# Altium schematic sheet Sense_Plates.SchDoc
size Tabloid; Organization: Altium Limited; Address1: L3, 12a Rodborough Rd; Address2: Frenchs Forest; Address3: NSW; Address4: Australia 2086
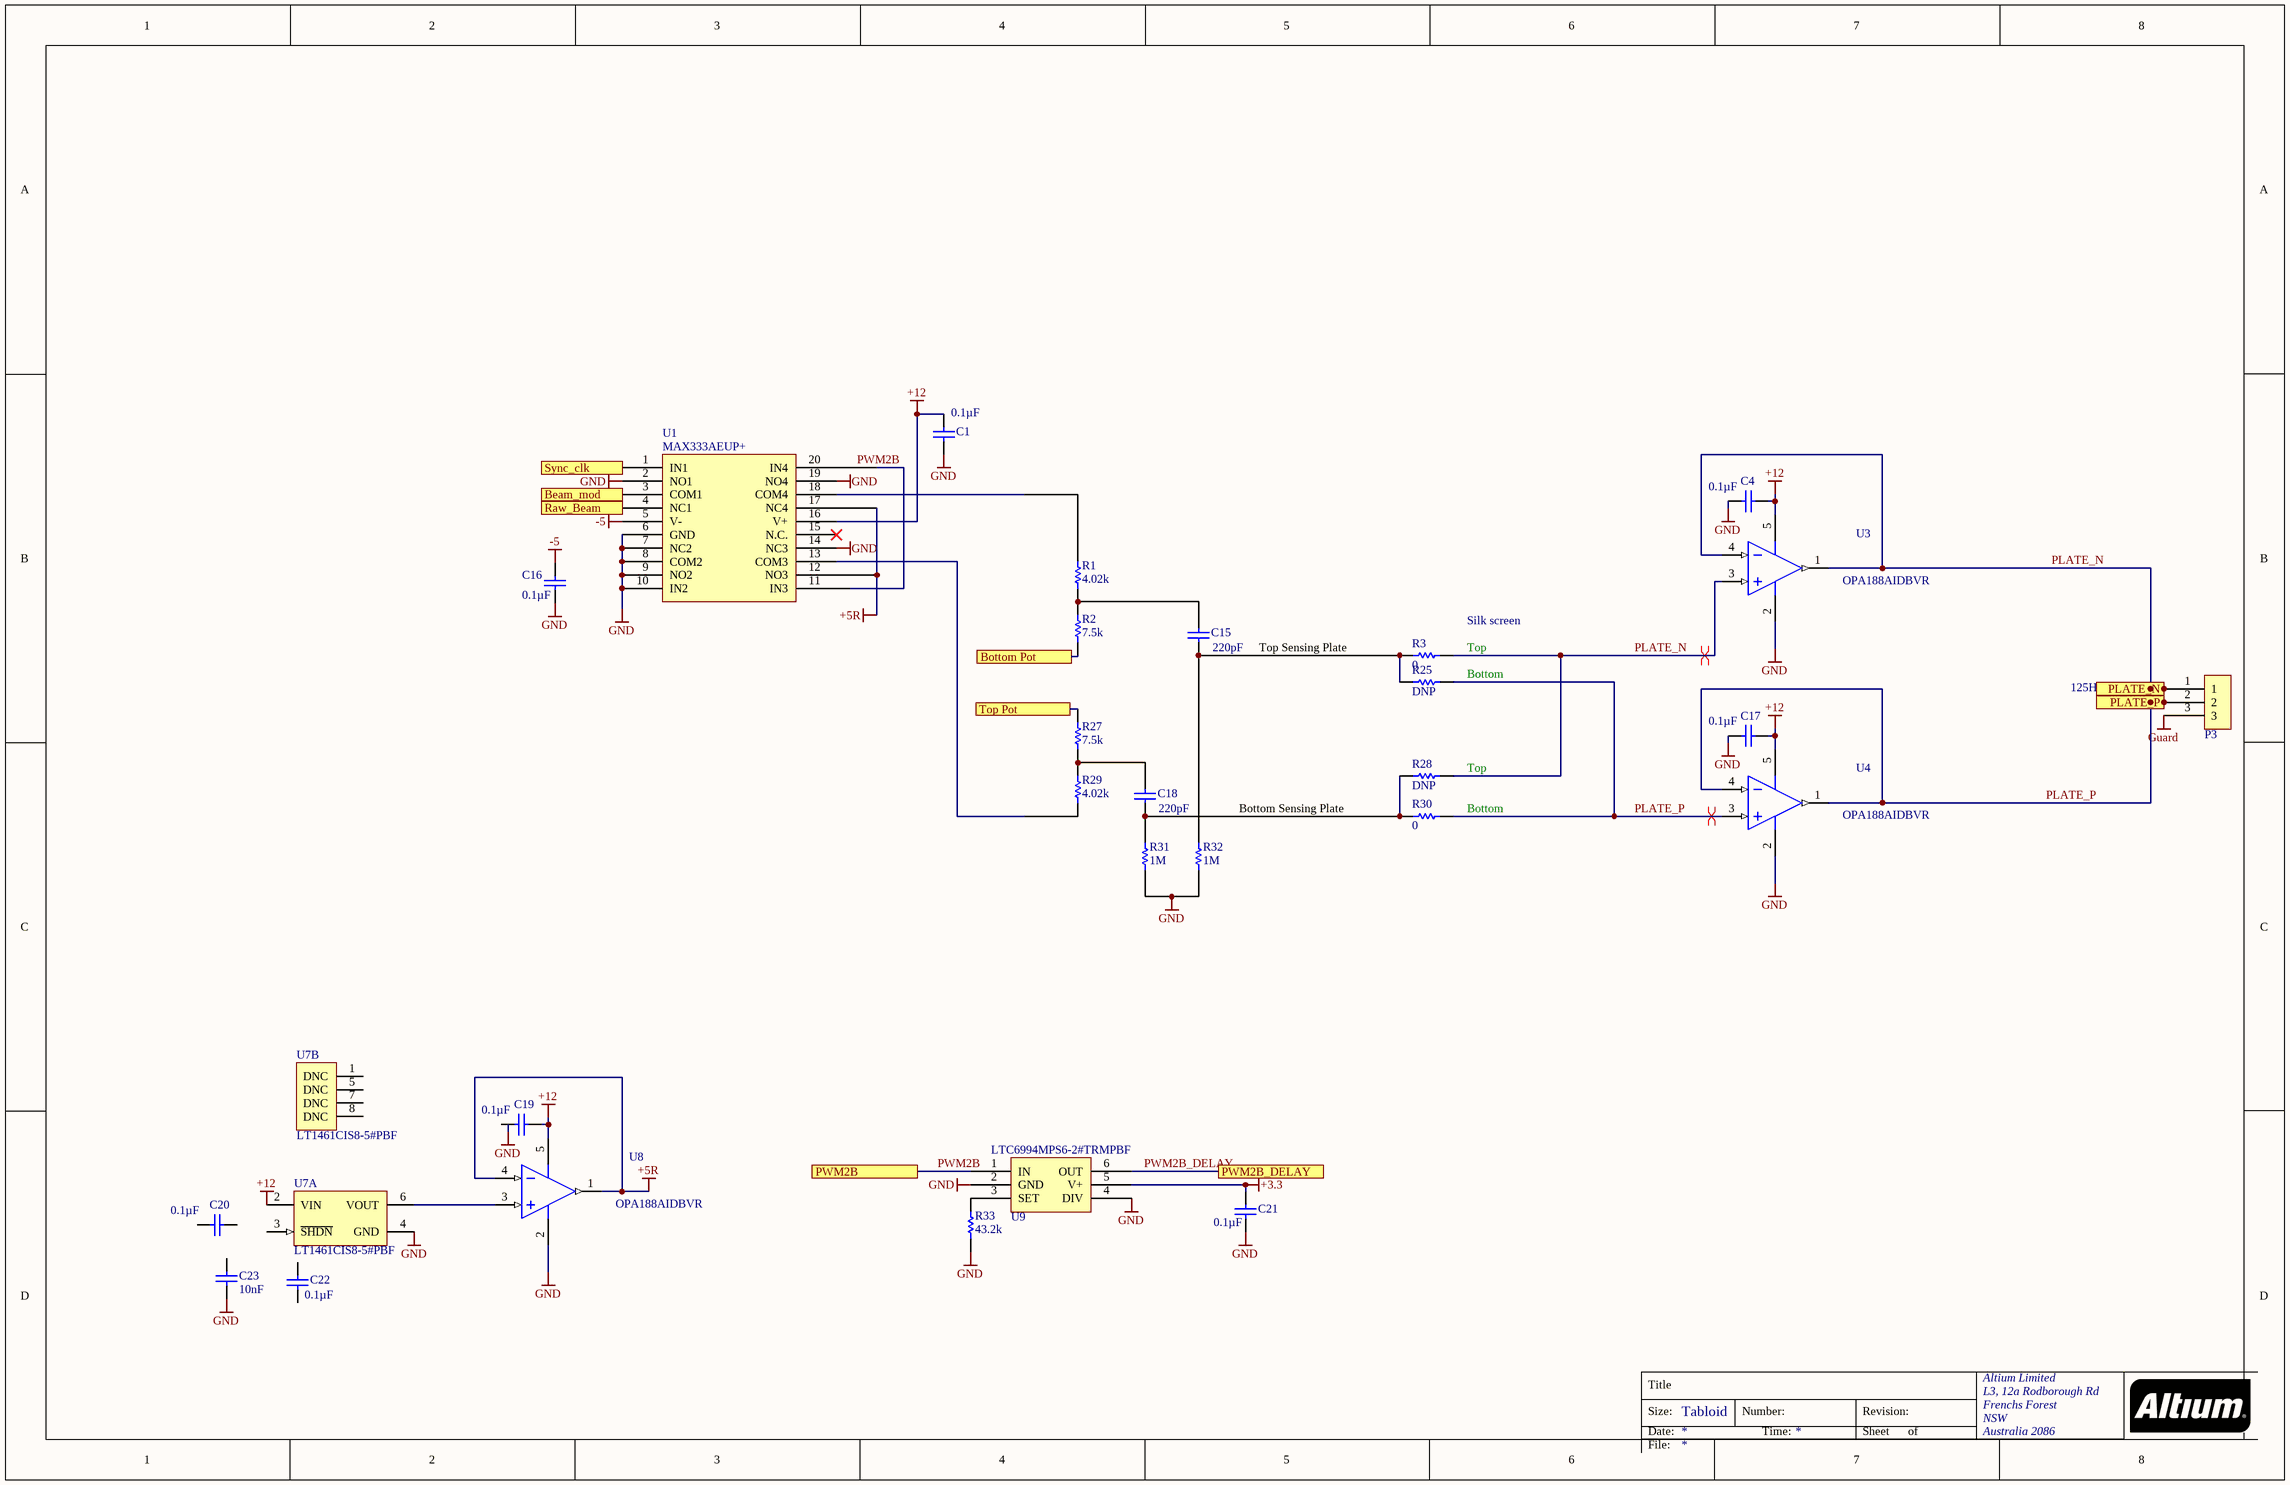
[diagram p0: Sense_Plates.SchDoc]

## Parts
C1  Capacitance: 0.1µF  [CAPC0805(2012)145_N]  (hidden comment: CAP CER 0.1UF 25V X7R 0805)
C4  Capacitance: 0.1µF  [CAPC0805(2012)145_N]  (hidden comment: CAP CER 0.1UF 25V X7R 0805)
C15  Capacitance: 220pF  [CAPC0805(2012)155_L]  (hidden comment: CAP CER 1UF 25V X7R 0805)
C16  Capacitance: 0.1µF  [CAPC0805(2012)145_N]  (hidden comment: CAP CER 0.1UF 25V X7R 0805)
C17  Capacitance: 0.1µF  [CAPC0805(2012)145_N]  (hidden comment: CAP CER 0.1UF 25V X7R 0805)
C18  Capacitance: 220pF  [CAPC0805(2012)155_L]  (hidden comment: CAP CER 1UF 25V X7R 0805)
C19  Capacitance: 0.1µF  [CAPC0805(2012)145_N]  (hidden comment: CAP CER 0.1UF 25V X7R 0805)
C20  Capacitance: 0.1µF  [CAPC0805(2012)145_N]  (hidden comment: CAP CER 0.1UF 25V X7R 0805)
C21  Capacitance: 0.1µF  [CAPC0805(2012)145_N]  (hidden comment: CAP CER 0.1UF 25V X7R 0805)
C22  Capacitance: 0.1µF  [CAPC0805(2012)145_N]  (hidden comment: CAP CER 0.1UF 25V X7R 0805)
C23  Capacitance: 10nF  [CAPC0805(2012)145_N]  (hidden comment: Multilayer Ceramic Capacitors MLCC - SMD/SMT 0.01uF 50volts 10% X7R)
P3  Triax_Conn  [Triax_Conn]  (value not drawn)
R1  4.02k  [RESC0402(1005)_M]
R2  7.5k  [RESC0402(1005)_M]
R3  0  [RESC0402(1005)_M]
R25  DNP  [RESC0402(1005)_M]
R27  7.5k  [RESC0402(1005)_M]
R28  DNP  [RESC0402(1005)_M]
R29  4.02k  [RESC0402(1005)_M]
R30  0  [RESC0402(1005)_M]
R31  1M  [RESC0402(1005)_M]
R32  1M  [RESC0402(1005)_M]
R33  43.2k  [RESC0402(1005)_M]
U1  MAX333AEUP+  [TSOP65P640X90-20N]
U3  OPA188AIDBVR  [DBV0005A_M]
U4  OPA188AIDBVR  [DBV0005A_M]
U7  LT1461CIS8-5#PBF  [LT-S8-8_L]  (parts A,B of 2)
U8  OPA188AIDBVR  [DBV0005A_M]
U9  LTC6994MPS6-2#TRMPBF  [LTC6994MPS6-2#TRMPBF]

## Ports
Beam_mod, Bottom Pot, PLATE_N, PLATE_P, PWM2B, PWM2B_DELAY, Raw_Beam, Sync_clk, Top Pot

## Nets
+3.3: C21.1 U9.5(V+)
+5R: U1.12(NO3) U1.17(NC4) U8.1(OUT) U8.4(IN-)
+12: C1.1 C4.2 C17.2 C19.2 U1.16(V+) U3.5(V+) U4.5(V+) U7.2(VIN) U8.5(V+)
-5: C16.1 U1.5(V-)
GND: C1.2 C4.1 C16.2 C17.1 C21.2 C23.2 R31.1 R32.1 R33.1 U1.2(NO1) U1.6(GND) U1.7(NC2) U1.8(COM2) U1.9(NO2) U1.10(IN2) U1.14(NC3) U1.19(NO4) U3.2(V-) U4.2(V-) U7.4(GND) U8.2(V-) U9.2(GND) U9.4(DIV)
Guard: P3.3
Beam_mod: U1.3(COM1) ; port Beam_mod
Bottom Pot: R2.1 ; port Bottom Pot
PLATE_N: P3.1 R3.1 R28.1 U3.1(OUT) U3.3(IN+) U3.4(IN-) ; port PLATE_N
PLATE_P: P3.2 R25.1 R30.1 U4.1(OUT) U4.3(IN+) U4.4(IN-) ; port PLATE_P
PWM2B: U1.11(IN3) U1.20(IN4) U9.1(IN) ; port PWM2B
PWM2B_DELAY: U9.6(OUT) ; port PWM2B_DELAY
Raw_Beam: U1.4(NC1) ; port Raw_Beam
Sync_clk: U1.1(IN1) ; port Sync_clk
Top Pot: R27.2 ; port Top Pot
NetC15_1: C15.1 R3.2 R25.2 R32.2
NetC15_2: C15.2 R1.1 R2.2
NetC18_1: C18.1 R28.2 R30.2 R31.2
NetC18_2: C18.2 R27.1 R29.2
NetR1_2: R1.2 U1.18(COM4)
NetR29_1: R29.1 U1.13(COM3)
NetR33_2: R33.2 U9.3(SET)
NetU7_6: U7.6(VOUT) U8.3(IN+)

Not connected (* = marked no-connect by the designer): C19 1; C20 1 2; C22 1 2; C23 1; U1 15(N.C.)*; U7 1(DNC) 3(~{SHDN}) 5(DNC) 7(DNC) 8(DNC)

## Layout directives
differential pair: PLATE_N, PLATE_P

## Notes on the sheet
- Silk screen
- Top Sensing Plate
- Top
- Bottom
- 125Hz
- Bottom Sensing Plate
- (near R28) Top
- Title
- Size:
- Date:
- Tabloid
- Number:
- Time:
- Revision:
- Sheet
- of
- File:

## Library data of the parts
C1 C4 C16 C17 C19-C22 = CMP-1036-04795-1: Manufacturer: Murata Electronics North America; Manufacturer Part Number: GRM21BR71E104KA01L; Tolerance: ±10%; Supplier 1: Digi-Key; Supplier Part Number 1: 490-1673-6-ND; RoHS: RoHS Compliant; Category: Capacitors; Stock 1: 891652; Pricing 1: 1=0.2, 10=0.145, 100=0.0683, 500=0.04788, 1000=0.03964 (USD); Packaging: Digi-Reel®; Part Status: Active; Voltage - Rated: 25V; Temperature Coefficient: X7R; Operating Temperature: -55°C ~ 125°C; Features: -; Ratings: -; Applications: General Purpose; Mounting Type: Surface Mount, MLCC; Package / Case: 0805 (2012 Metric); Size / Dimension: 0.079" L x 0.049" W (2.00mm x 1.25mm); Height - Seated (Max): -; Thickness (Max): 0.053" (1.35mm); Lead Spacing: -; Lead Style: -; ComponentLink1URL: http://www.murata.com/~/media/webrenewal/support/library/catalog/products/capacitor/mlcc/c02e.ashx; ComponentLink1Description: http://www.murata.com/~/media/webrenewal/support/library/catalog/products/capacitor/mlcc/c02e.ashx
C15 C18 = CMP-1036-04882-1: Manufacturer: Murata Electronics North America; Manufacturer Part Number: GRM21BR71E105KA99L; Tolerance: ±10%; Supplier 1: Digi-Key; Supplier Part Number 1: 490-6484-6-ND; RoHS: RoHS Compliant; Category: Capacitors; Stock 1: 295074; Pricing 1: 1=0.14, 10=0.099, 100=0.0468, 500=0.0328, 1000=0.02715 (USD); Packaging: Digi-Reel®; Part Status: Active; Voltage - Rated: 25V; Temperature Coefficient: X7R; Operating Temperature: -55°C ~ 125°C; Features: -; Ratings: -; Applications: General Purpose; Mounting Type: Surface Mount, MLCC; Package / Case: 0805 (2012 Metric); Size / Dimension: 0.079" L x 0.049" W (2.00mm x 1.25mm); Height - Seated (Max): -; Thickness (Max): 0.053" (1.35mm); Lead Spacing: -; Lead Style: -; ComponentLink1URL: http://www.murata.com/~/media/webrenewal/support/library/catalog/products/capacitor/mlcc/c02e.ashx; ComponentLink1Description: http://www.murata.com/~/media/webrenewal/support/library/catalog/products/capacitor/mlcc/c02e.ashx
C23 = CMP-1036-04795-1: Manufacturer: Kemet; Manufacturer Part Number: C0805C103K5RACAUTO; Voltage Rating: 50V; Supplier 1: Digi-Key; Supplier Part Number 1: 399-6924-1-ND; Stock 1: 63236; Pricing 1: 1=0.12, 10=0.087, 100=0.041, 500=0.0287, 1000=0.0238 (USD); Mount: Surface Mount; Case/Package: 0805; Case Code (Metric): 2012; Case Code (Imperial): 0805; Dielectric Material: Ceramic; Contact Plating: Tin; Min Operating Temperature: -55°C; Max Operating Temperature: 125°C; Tolerance: 10%; Packaging: Tape and Reel; Package Quantity: 1; Voltage Rating (DC): 50V; Dielectric: X7R; Termination: SMD/SMT; Length: 2mm; Height: 0.78mm; Width: 0.049inch; Thickness: 0.035inch; Depth: 1.25mm; Radiation Hardening: No; REACH SVHC: No SVHC; ComponentLink1URL: https://datasheet.ciiva.com/22700/1693454-22700519.pdf; ComponentLink1Description: https://datasheet.ciiva.com/22700/1693454-22700519.pdf; ComponentLink2URL: https://datasheet.ciiva.com/7842/1693454-7842175.pdf; ComponentLink2Description: https://datasheet.ciiva.com/7842/1693454-7842175.pdf
R1-R3 R25 R27-R33 = CMP-1011-00463-1
U1 = MAX333CWP+: IC SWITCH QUAD SPDT 20TSSOP; Manufacturer: Maxim Integrated; Multiplexer/Demultiplexer Circuit: 2:1; On-State Resistance (Max): 45 Ohm; Channel-to-Channel Matching (&Delta;Ron): 2 Ohm (Max); Voltage - Supply, Single (V+): 10 V ~ 30 V; Voltage - Supply, Dual (V±): ±4.5 V ~ 20 V; Switch Time (Ton, Toff) (Max): 175ns, 145ns; Charge Injection: 2pC; Channel Capacitance (CS(off), CD(off)): 5pF; Current - Leakage (IS(off)) (Max): 250pA; Crosstalk: -78dB @ 1MHz; Supplier 1: Digi-Key; Supplier Part Number 1: MAX333AEUP+-ND; Manufacturer Part Number: MAX333AEUP+; RoHS: RoHS Compliant; Category: Integrated Circuits (ICs); Stock 1: 1328; Pricing 1: 1=6.77, 10=6.432, 25=6, 50=5.8942 (USD); Packaging: Tube; Part Status: Active; Switch Circuit: SPDT; -3db Bandwidth: -; Operating Temperature: -40°C ~ 85°C (TA); Package / Case: 20-TSSOP (0.173", 4.40mm Width); Supplier Device Package: 20-TSSOP; Base Part Number: MAX333; ComponentLink1URL: https://pdfserv.maximintegrated.com/en/ds/MAX333A.pdf; ComponentLink1Description: https://pdfserv.maximintegrated.com/en/ds/MAX333A.pdf
U3 U4 U8 = CMP-0809-00005-2: Precision, Low Noise, Rail-to-Rail Output, Zero-Drift Operational Amplifier, 4 to 36 V, -40 to 125 degC, 5-pin SOT23 (DBV5), Green (RoHS & no Sb/Br); Manufacturer: Texas Instruments; Total Supply Voltage(Min)(+5V is 5, +/-5V is 10): 4; Offset Drift(Typ)(uV/C): 0.03; Rating: Catalog; SubFamily: Zero Drift Precision Amplifier; GBW(Typ)(MHz): 2; Slew Rate(Typ)(V/us): 0.8; Number of Channels: 1; CMRR(Min)(dB): 120; Iq per channel(Max)(mA): 0.51; Total Supply Voltage(Max)(+5V is 5, +/-5V is 10): 36; PartNumber: OPA188AIDBVR; ComponentLink2Description: Datasheet; ComponentLink2URL: http://www.ti.com/lit/ds/symlink/opa188.pdf; ComponentLink1Description: Manufacturer URL; Mounting Technology: Surface Mount; Eco-Plan: Green (RoHS & no Sb/Br); ComponentLink1URL: http://www.ti.com/; PackageVersion: 4073253-4/K, 03/2006; DatasheetVersion: SBOS642A; ComponentLink3Description: Package Specification; PackageReference: DBV0005A; ComponentLink3URL: http://www.ti.com/litv/pdf/mpds018i; PackageDescription: 5-Pin Plastic Small Outline, Body 1.6 x 2.9 mm, Pitch 0.95 mm; Code_JEDEC: MO-178
U7 = CMP-2000-06607-1: Micropower Precision Low Dropout Voltage Reference, 5 V, -40 to 85 degC, 8-Pin SOIC, RoHS, Tube; Manufacturer: Linear Technology; Temperature Coefficient: 12ppm/°C; Product Training Modules: VoltageReferenceBasics; Voltage - Output: 5V; Voltage - Input: 5.5V~20V; Package Version: 0; Tolerance: ±0.08%; Current - Quiescent: 50µA; Number of Channels: 1; Current - Output: 100mA; Dynamic Catalog: Series,Fixed-LinearTechnology; Reference Type: Series,Precision; Current - Cathode: -; Standard Package: 100; Supplier Device Package: 8-SOIC; Packaging: Tube; Category: IntegratedCircuits(ICs); Package Reference: S8; Series: -; Family: PMIC-VoltageReference; Datasheet URL: http://cds.linear.com/docs/en/datasheet/1461fb.pdf; Package Description: 8-Pin Plastic Small Outline (Narrow .150 Inch), Body 4.9 x 3.9 mm, Pitch 1.27 mm; Mounting Type: SurfaceMount; Datasheet Version: Rev. B, 09/2015; Manufacturer URL: http://www.linear.com/; Mounting Technology: SurfaceMount; Operating Temperature: -40°C~85°C; Package URL: http://cds.linear.com/docs/Packaging/05081610_G_SO8.pdf; PartId: 1
U9 = LTC6994MPS6-2#TRMPBF: IC DELAY BLOCK 8TAP PROG TSOT23; Manufacturer: Linear Technology/Analog Devices; Manufacturer Part Number: LTC6994CS6-2#TRMPBF; Function: Programmable; Available Total Delays: 1µs ~ 33.6s; Voltage - Supply: 2.25 V ~ 5.5 V; Supplier 1: Digi-Key; Supplier Part Number 1: LTC6994CS6-2#TRMPBFCT-ND; RoHS: RoHS Compliant; Category: Integrated Circuits (ICs); Stock 1: 1401; Pricing 1: 1=3.42, 25=3.0496, 100=1.9217, 250=1.76156 (USD); Packaging: Cut Tape (CT); Part Status: Active; Delay to 1st Tap: -; Operating Temperature: 0°C ~ 70°C; Mounting Type: Surface Mount; Package / Case: SOT-23-6 Thin, TSOT-23-6; Supplier Device Package: TSOT-23-6; Base Part Number: LTC6994; ComponentLink1URL: http://www.linear.com/docs/29725; ComponentLink1Description: http://www.linear.com/docs/29725